# Altium schematic sheet Ethernet_bridge(TOP).SchDoc
size 900 x 699 mm; SheetNumber: 1; SheetTotal: 1; SPICEModelCacheNLVBOJOE: <root> / <DocumentId>NLVBOJOE</DocumentId> / <CacheFrame Number="0"> / <Model Name="5848_744774033_3.3u" Kind="CKT"> / <Text>******* / .subckt 5848_744774033_3.3u 1 2 / Rp 1 2 12000 / Cp 1 2 3.4p / Rs 1 N3 0.042 / L1 N3 2 3.3u / .ends 5848_744774033_3.3u</Text> / </Model> / </CacheFrame> / </root>
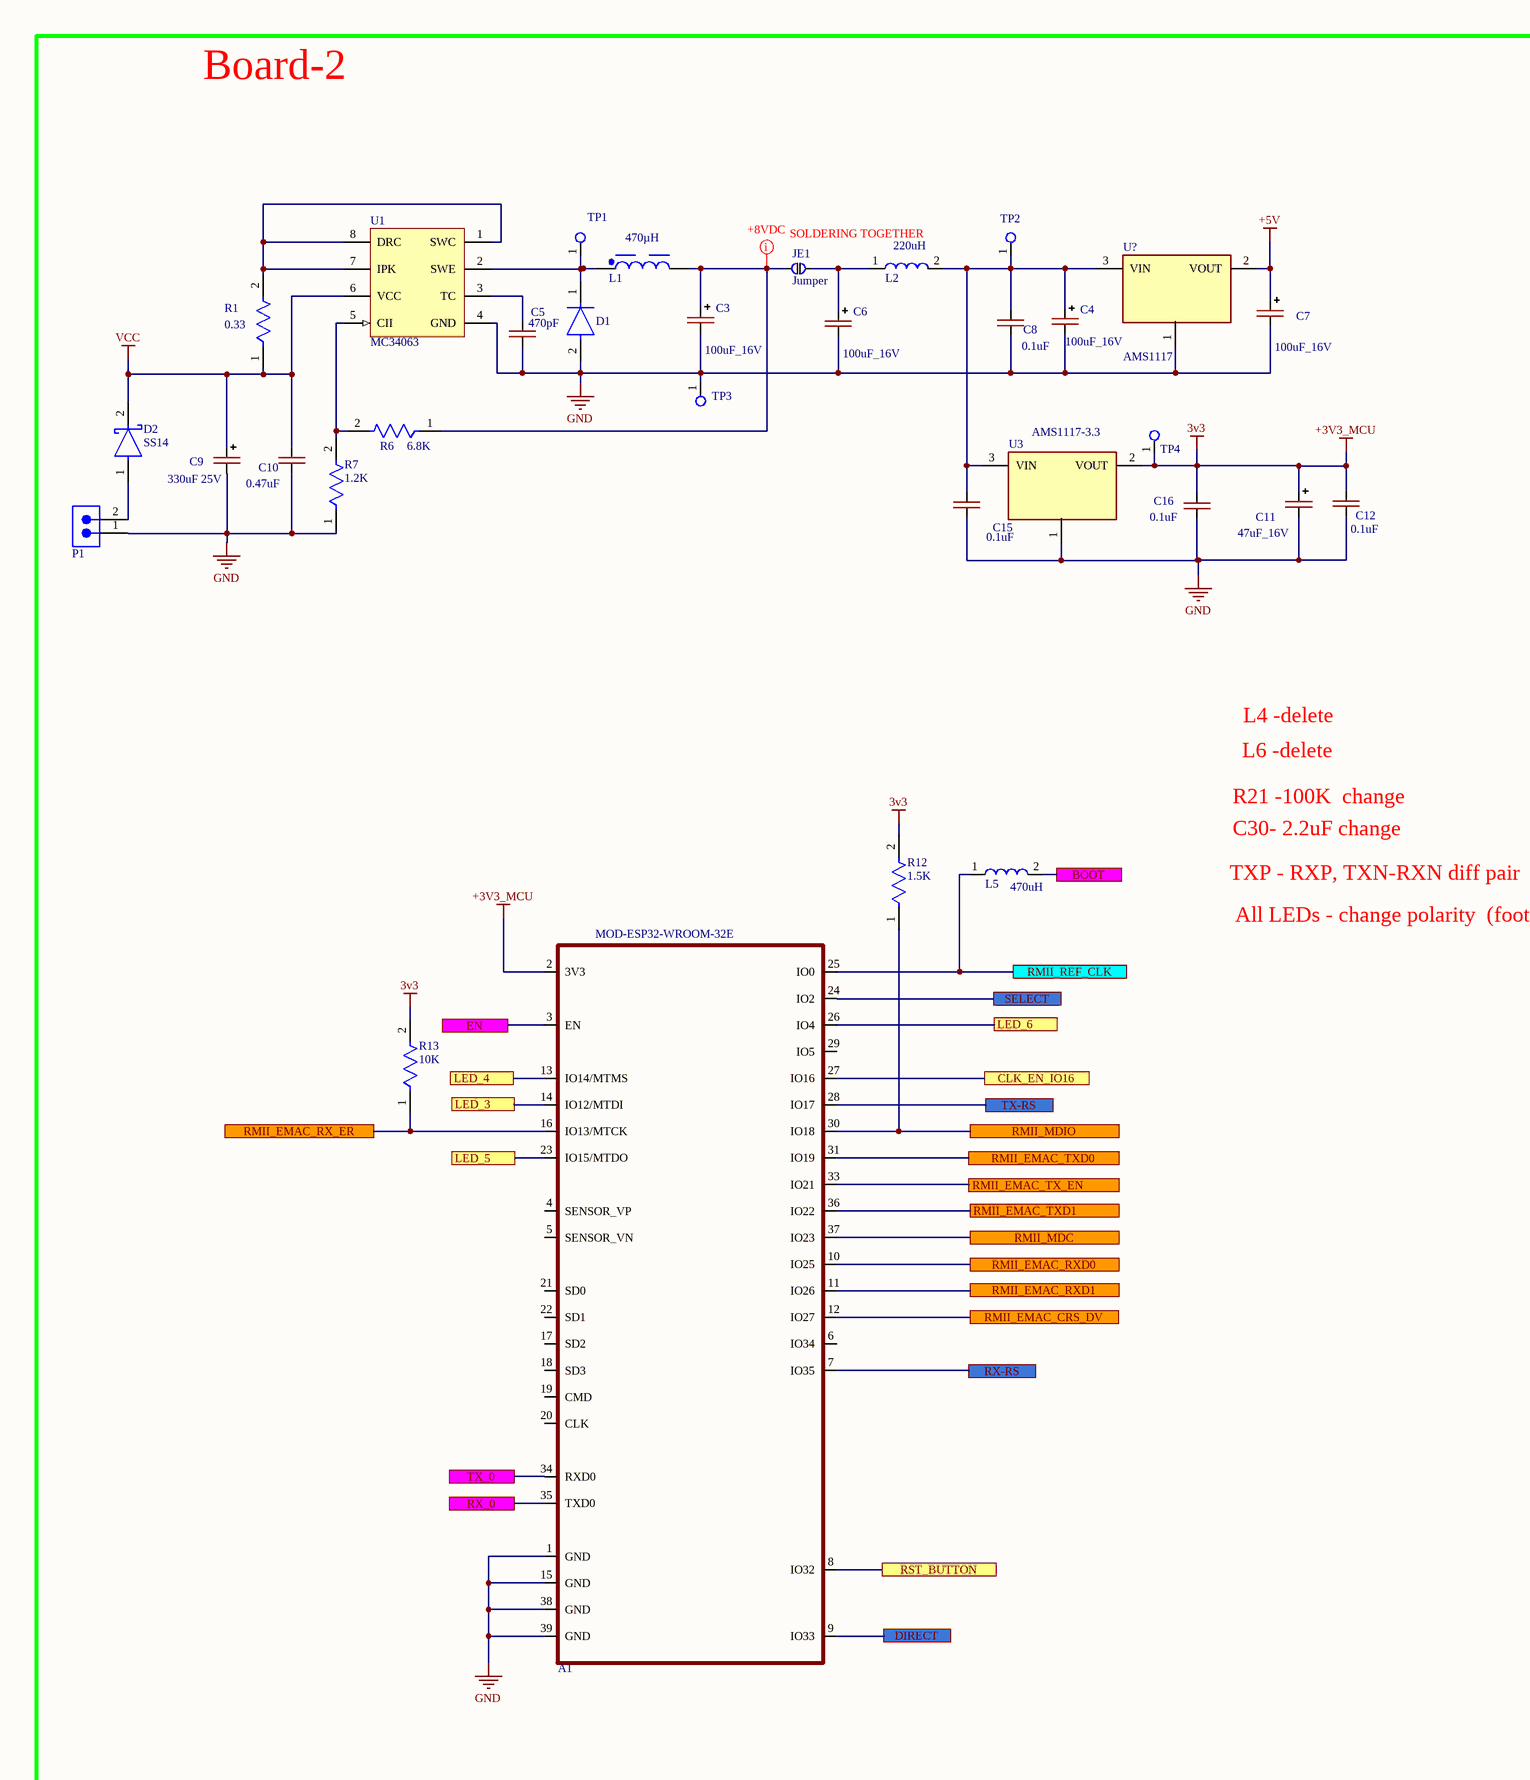
[diagram p0: Ethernet_bridge(TOP).SchDoc, left]
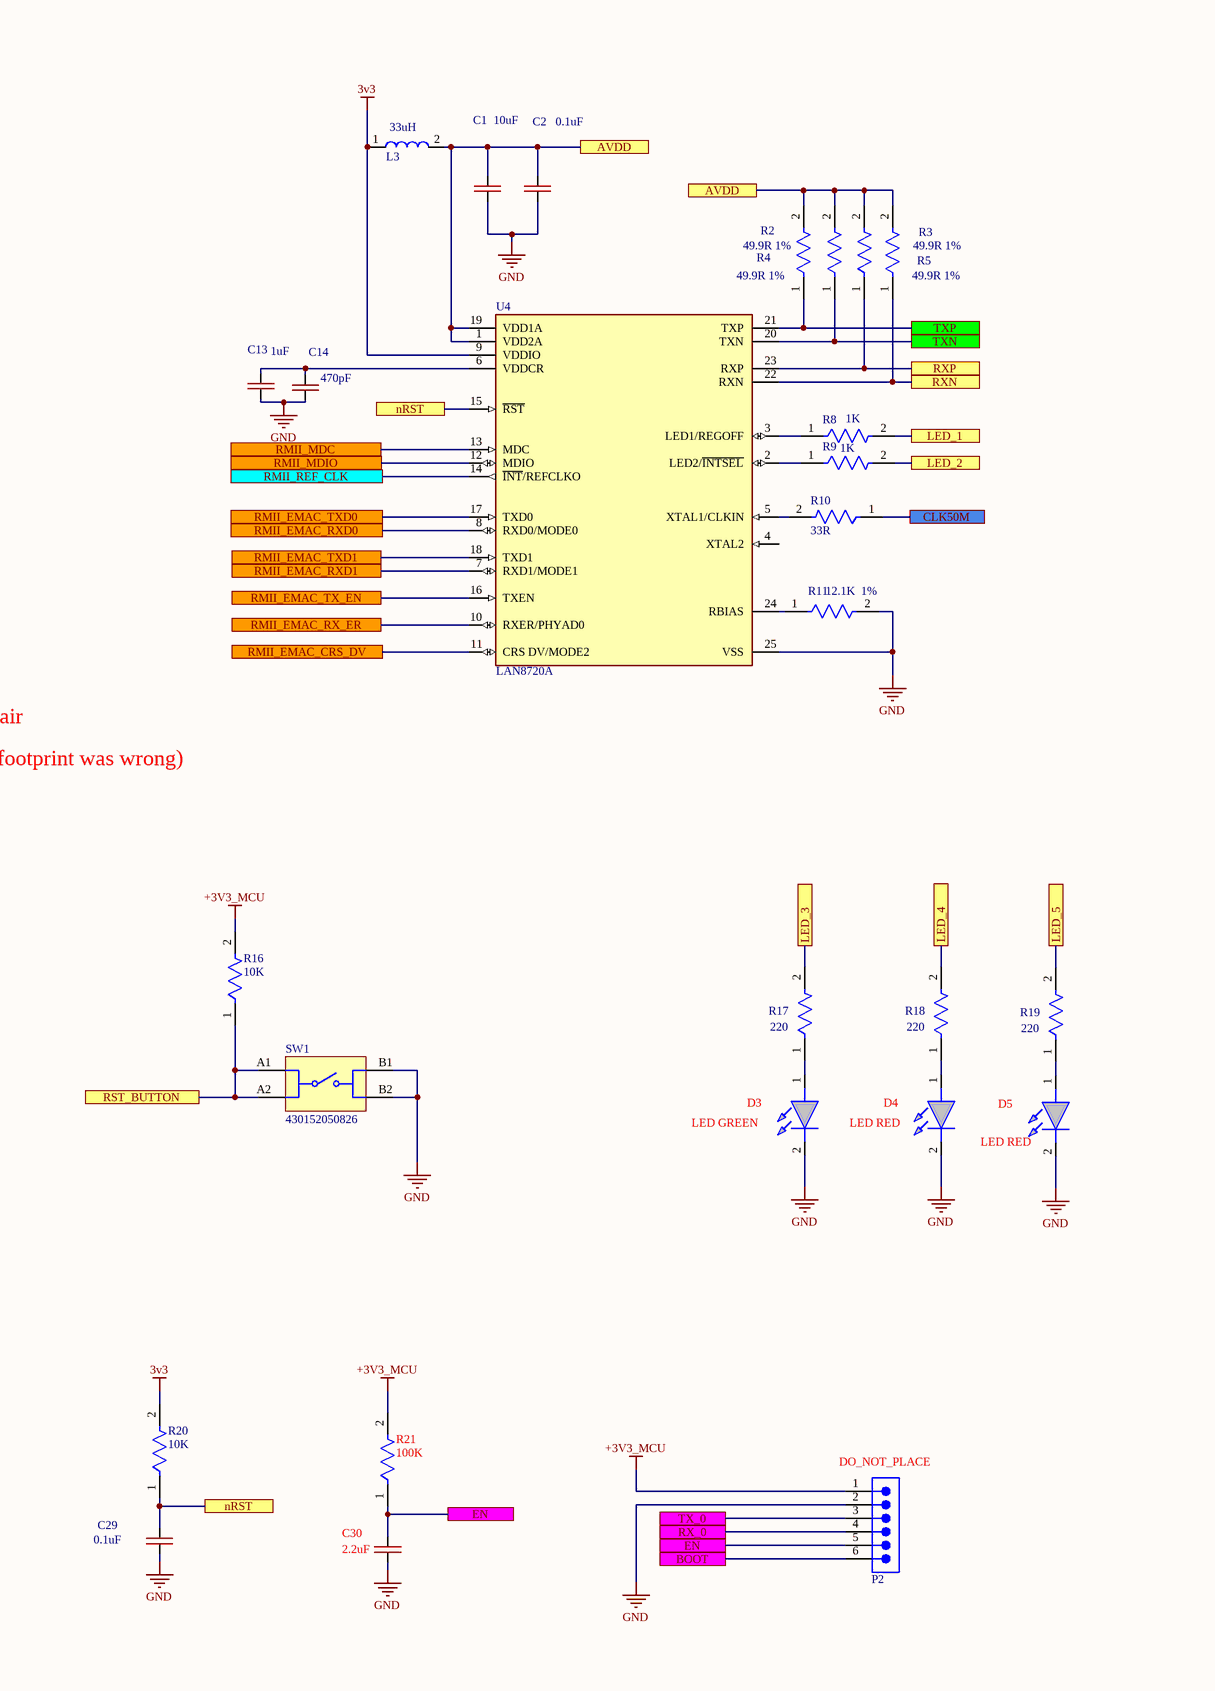
[diagram p1: Ethernet_bridge(TOP).SchDoc, middle]
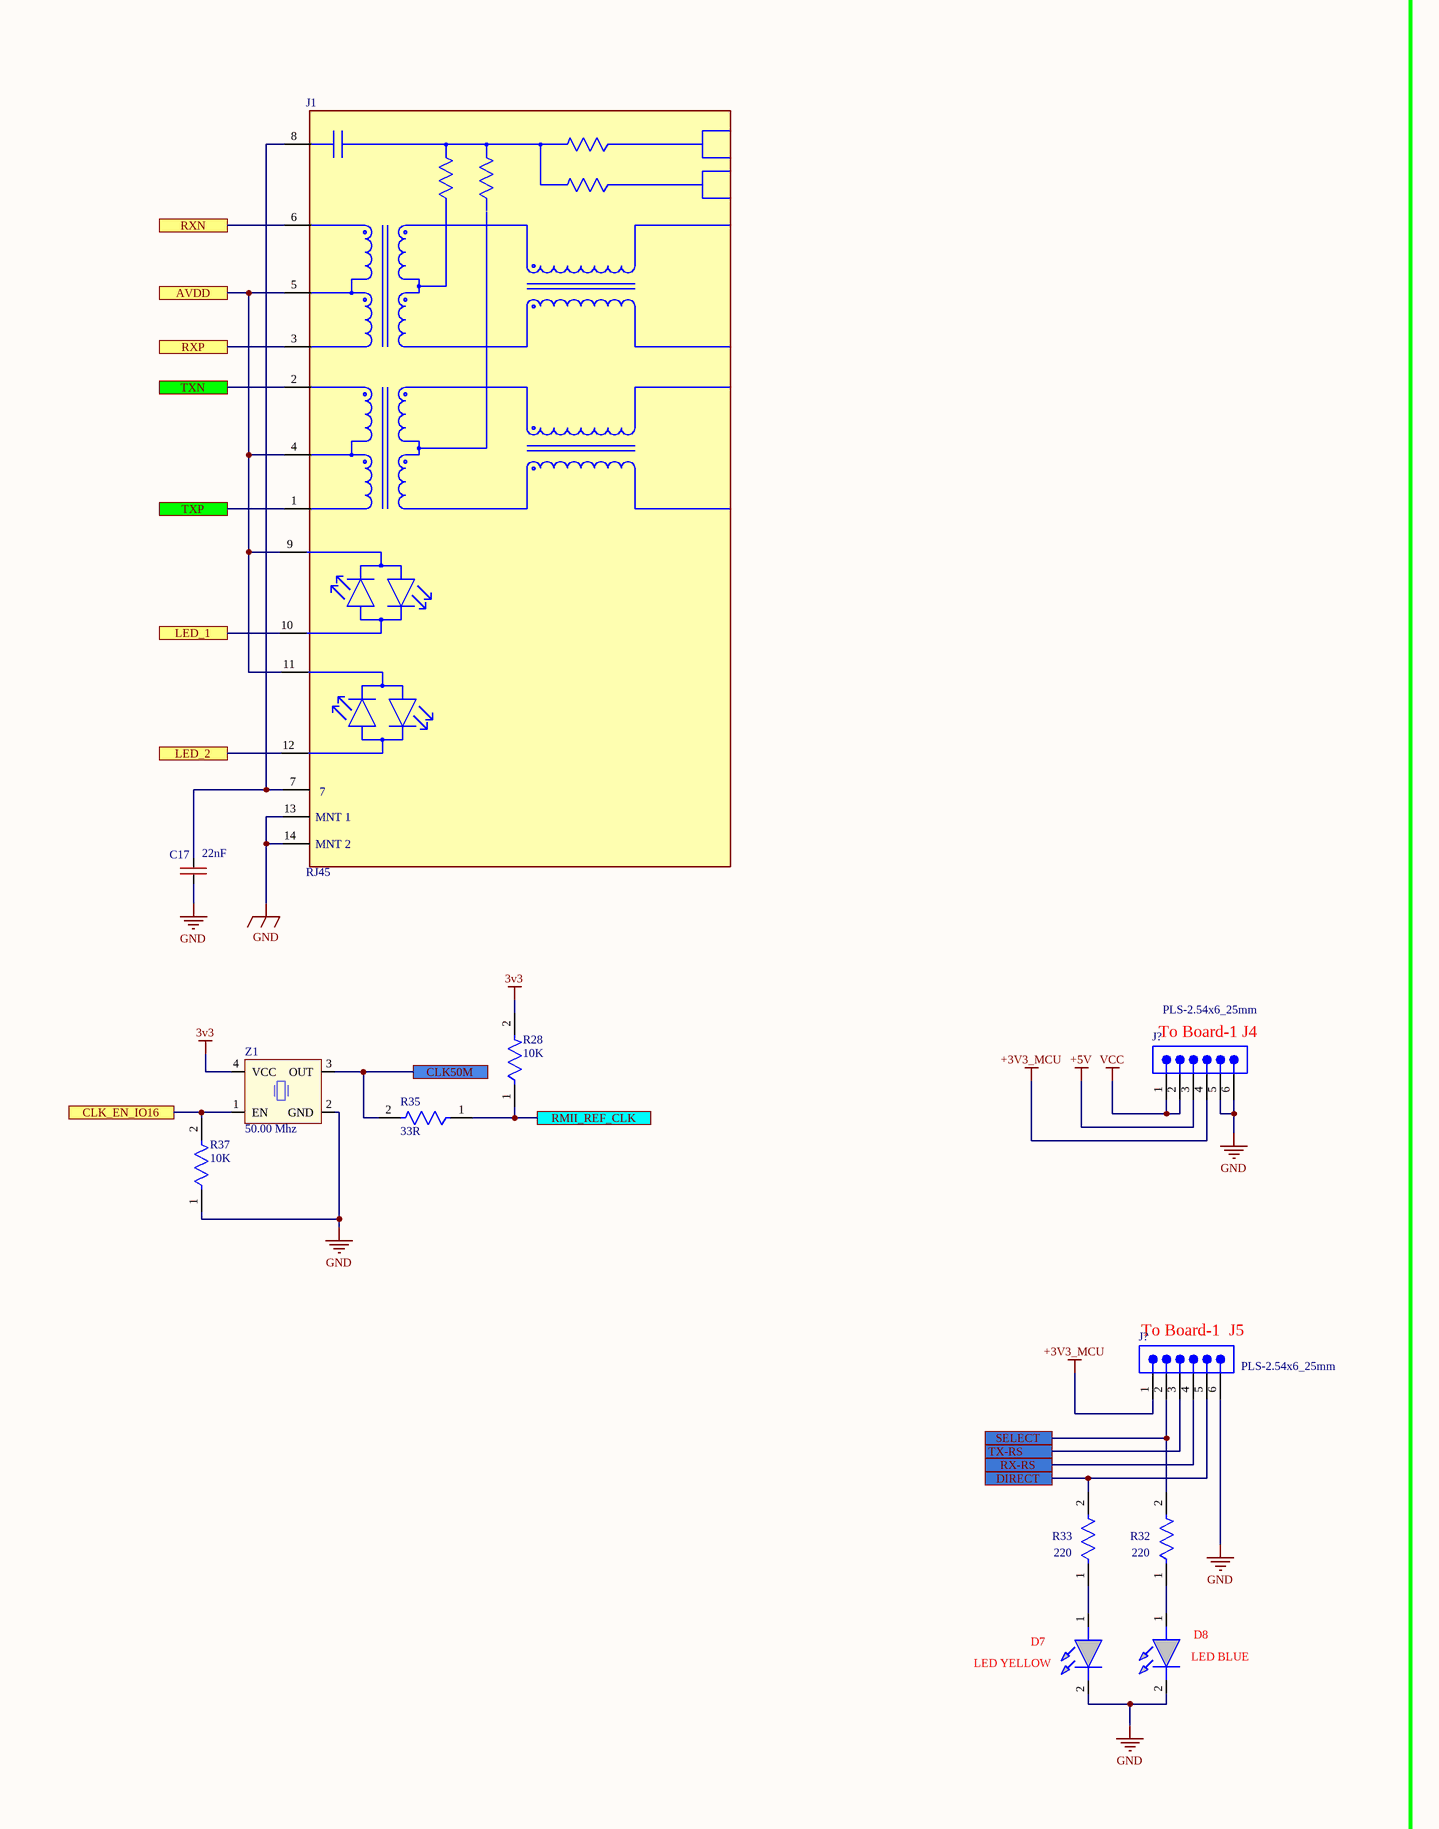
[diagram p2: Ethernet_bridge(TOP).SchDoc, right]

## Parts
(Parts that share a designator on the sheet are numbered #1, #2 ... from top to bottom, then left to right.)
A1  MOD-ESP32-WROOM-32E  [MOD-ESP32-WROOM-32E]
C1  10uF  [CAP-0805]
C2  0.1uF  [CAP-0805]
C3  100uF_16V  [CAP-TAN-D]
C4  100uF_16V  [CAP-TAN-D]
C5  470pF  [CAP-0603]
C6  100uF_16V  [CAP-TAN-D]
C7  100uF_16V  [CAP-TAN-D]
C8  0.1uF  [CAP-0603]
C9  330uF 25V  [CAP_SMD_Size_E]
C10  0.47uF  [CAP-0805]
C11  47uF_16V  [CAP-TAN-D]
C12  0.1uF  [CAP-0603]
C13  1uF  [CAP-0603]
C14  470pF  [CAP-0603]
C15  0.1uF  [CAP-0603]
C16  0.1uF  [CAP-0603]
C17  22nF  [CAP-0603]
C29  0.1uF  [CAP-0603]
C30  2.2uF  [CAP-0603]
D1  ES1G  [FP-403AE-MFG]  (value not drawn)
D2  SS14  [DO-214-AC]
D3  LED GREEN  [LED_GREEN]
D4  LED RED  [LED_RED]
D5  LED RED  [LED_RED]
D7  LED YELLOW  [LED_YELLOW]
D8  LED BLUE  [LED_BLUE]
J1  RJ45  [RJ-45]
J?#1  PLS-2.54x6_25mm  [PLS2.54x25mm]
J?#2  PLS-2.54x6_25mm  [PLS2.54x25mm]
JE1  Jumper  [JE]
L1  470µH  [WE-PD2_5848]
L2  220uH  [Coil_4.5x4.5_mm]
L3  33uH  [Coil_4.5x4.5_mm]
L5  470uH  [Coil_4.5x4.5_mm]
P1  691305540002  [691305540002]  (value not drawn)
P2  61300611121  [61300611121]  (value not drawn)
R1  0.33  [RES-1206]
R2  49.9R 1%  [RES-0603]
R3  49.9R 1%  [RES-0603]
R4  49.9R 1%  [RES-0603]
R5  49.9R 1%  [RES-0603]
R6  6.8K  [RES-0805]
R7  1.2K  [RES-0805]
R8  1K  [RES-0603]
R9  1K  [RES-0603]
R10  33R  [RES-0603]
R11  12.1K  1%  [RES-0603]
R12  1.5K  [RES-0603]
R13  10K  [RES-0603]
R16  10K  [RES-0603]
R17  220  [RES-0603]
R18  220  [RES-0603]
R19  220  [RES-0603]
R20  10K  [RES-0603]
R21  100K  [RES-0603]
R28  10K  [RES-0603]
R32  220  [RES-0603]
R33  220  [RES-0603]
R35  33R  [RES-0603]
R37  10K  [RES-0603]
SW1  430152050826  [430152050826]
TP1  Test_Point_PCB  [Test_Point]  (value not drawn)
TP2  Test_Point_PCB  [Test_Point]  (value not drawn)
TP3  Test_Point_PCB  [Pin_Test_Point(Orange)]  (value not drawn)
TP4  Test_Point_PCB  [Test_Point]  (value not drawn)
U1  MC34063  [SOIC-8_M]
U3  AMS1117-3.3  [SOT-89]
U4  LAN8720A  [24QFN-4x4B-IPC_A]
U?  AMS1117  [SOT-89]
Z1  50.00 Mhz  [50.00Mhz active quartz]

## Ports
AVDD (see Ethernet_bridge(TOP)[3A]), AVDD (see Ethernet_bridge(TOP)[3A], Ethernet_bridge(TOP)[4A]), BOOT (see Ethernet_bridge(TOP)[2B]), BOOT (see Ethernet_bridge(TOP)[3C]), CLK50M (see Ethernet_bridge(TOP)[4B]), CLK50M (see Ethernet_bridge(TOP)[5B]), CLK_EN_IO16 (see Ethernet_bridge(TOP)[2B]), CLK_EN_IO16 (see Ethernet_bridge(TOP)[4B]), DIRECT (see Ethernet_bridge(TOP)[2C]), DIRECT (see Ethernet_bridge(TOP)[5C]), EN (see Ethernet_bridge(TOP)[1B], Ethernet_bridge(TOP)[3C]), EN (see Ethernet_bridge(TOP)[3C]), LED_1 (see Ethernet_bridge(TOP)[4A]), LED_1 (see Ethernet_bridge(TOP)[4B]), LED_2 (see Ethernet_bridge(TOP)[4B]), LED_3 (see Ethernet_bridge(TOP)[1B]), LED_3 (see Ethernet_bridge(TOP)[3B]), LED_4 (see Ethernet_bridge(TOP)[1B]), LED_4 (see Ethernet_bridge(TOP)[4B]), LED_5 (see Ethernet_bridge(TOP)[1B]), LED_5 (see Ethernet_bridge(TOP)[4B]), LED_6, nRST (see Ethernet_bridge(TOP)[3A]), nRST (see Ethernet_bridge(TOP)[3C]), RMII_EMAC_CRS_DV (see Ethernet_bridge(TOP)[2B]), RMII_EMAC_CRS_DV (see Ethernet_bridge(TOP)[3B]), RMII_EMAC_RX_ER (see Ethernet_bridge(TOP)[1B]), RMII_EMAC_RX_ER (see Ethernet_bridge(TOP)[3B]), RMII_EMAC_RXD0 (see Ethernet_bridge(TOP)[2B]), RMII_EMAC_RXD0 (see Ethernet_bridge(TOP)[3B]), RMII_EMAC_RXD1 (see Ethernet_bridge(TOP)[2B]), RMII_EMAC_RXD1 (see Ethernet_bridge(TOP)[3B]), RMII_EMAC_TX_EN (see Ethernet_bridge(TOP)[2B]), RMII_EMAC_TX_EN (see Ethernet_bridge(TOP)[3B]), RMII_EMAC_TXD0 (see Ethernet_bridge(TOP)[2B]), RMII_EMAC_TXD0 (see Ethernet_bridge(TOP)[3B]), RMII_EMAC_TXD1 (see Ethernet_bridge(TOP)[2B]), RMII_EMAC_TXD1 (see Ethernet_bridge(TOP)[3B]), RMII_MDC (see Ethernet_bridge(TOP)[2B]), RMII_MDC (see Ethernet_bridge(TOP)[3A]), RMII_MDIO (see Ethernet_bridge(TOP)[2B]), RMII_MDIO (see Ethernet_bridge(TOP)[3B]), RMII_REF_CLK (see Ethernet_bridge(TOP)[2B], Ethernet_bridge(TOP)[3B]), RMII_REF_CLK (see Ethernet_bridge(TOP)[2B], Ethernet_bridge(TOP)[5B]), RMII_REF_CLK (see Ethernet_bridge(TOP)[3B], Ethernet_bridge(TOP)[5B]), RST_BUTTON (see Ethernet_bridge(TOP)[2C]), RST_BUTTON (see Ethernet_bridge(TOP)[3B]), RX-RS (see Ethernet_bridge(TOP)[2B]), RX-RS (see Ethernet_bridge(TOP)[5C]), RX_0 (see Ethernet_bridge(TOP)[1B]), RX_0 (see Ethernet_bridge(TOP)[3C]), RXN (see Ethernet_bridge(TOP)[4A]), RXP (see Ethernet_bridge(TOP)[4A]), SELECT (see Ethernet_bridge(TOP)[2B]), SELECT (see Ethernet_bridge(TOP)[5C]), TX-RS (see Ethernet_bridge(TOP)[2B]), TX-RS (see Ethernet_bridge(TOP)[5C]), TX_0 (see Ethernet_bridge(TOP)[1B]), TX_0 (see Ethernet_bridge(TOP)[3C]), TXN (see Ethernet_bridge(TOP)[4A]), TXP (see Ethernet_bridge(TOP)[4A]), TXP (see Ethernet_bridge(TOP)[4B])

## Nets
+3V3_MCU: A1.2(3V3) C11.1(+) C12.2 C16.2 J?#1.4 J?#2.1 L3.1 P2.1 R12.2 R13.2 R16.2 R20.2 R21.2 R28.2 TP4.1(G9) U3.2(VOUT) U4.9(VDDIO) Z1.4(VCC)  [also labelled 3v3]
+5V: C7.1(+) J?#1.3 U?.2(VOUT)
GND: A1.1(GND) A1.15(GND) A1.38(GND) A1.39(GND) C1.1 C2.1 C3.2(-) C4.2(-) C5.2 C6.2(-) C7.2(-) C8.1 C9.2(-) C10.2 C11.2(-) C12.1 C13.1 C14.1 C15.1 C16.1 C17.1 C29.1 C30.1 D1.2(A) D3.2(K) D4.2(K) D5.2(K) D7.2(K) D8.2(K) J1.13(MNT_1) J1.14(MNT_2) J?#1.5 J?#1.6 J?#2.6 P1.1 P2.2 R7.1 R11.2 R37.1 SW1.B1 SW1.B2 TP3.1(G9) U1.4(GND) U3.1(Ground) U4.25(VSS) U?.1(Ground) Z1.2(GND)
VCC: C9.1(+) C10.1 D2.2(C) J?#1.1 J?#1.2 R1.1 U1.6(VCC)
AVDD: C1.2 C2.2 J1.4 J1.5 J1.9(2_ANODE_YELLOW/CATHODE_GREEN) J1.11(2_ANODE_YELLOW/CATHODE_GREEN) L3.2 R2.2 R3.2 R4.2 R5.2 U4.1(VDD2A) U4.19(VDD1A) ; port AVDD
BOOT: L5.2 P2.6 ; port BOOT
CLK50M: R10.1 R35.2 Z1.3(OUT) ; port CLK50M
CLK_EN_IO16: A1.27(IO16) R37.2 Z1.1(EN) ; port CLK_EN_IO16
DIRECT: A1.9(IO33) J?#2.5 R33.2 ; port DIRECT
EN: A1.3(EN) C30.2 P2.5 R21.1 ; port EN
LED_1: J1.10(2_CATHODE_YELLOW/ANODE_GREEN) R8.2 ; port LED_1
LED_2: J1.12(2_CATHODE_YELLOW/ANODE_GREEN) R9.2 ; port LED_2
LED_3: A1.14(IO12/MTDI) R17.2 ; port LED_3
LED_4: A1.13(IO14/MTMS) R18.2 ; port LED_4
LED_5: A1.23(IO15/MTDO) R19.2 ; port LED_5
LED_6: A1.26(IO4) ; port LED_6
nRST: C29.2 R20.1 U4.15(~{RST}) ; port nRST
RMII_EMAC_CRS_DV: A1.12(IO27) U4.11(CRS_DV/MODE2) ; port RMII_EMAC_CRS_DV
RMII_EMAC_RX_ER: A1.16(IO13/MTCK) R13.1 U4.10(RXER/PHYAD0) ; port RMII_EMAC_RX_ER
RMII_EMAC_RXD0: A1.10(IO25) U4.8(RXD0/MODE0) ; port RMII_EMAC_RXD0
RMII_EMAC_RXD1: A1.11(IO26) U4.7(RXD1/MODE1) ; port RMII_EMAC_RXD1
RMII_EMAC_TX_EN: A1.33(IO21) U4.16(TXEN) ; port RMII_EMAC_TX_EN
RMII_EMAC_TXD0: A1.31(IO19) U4.17(TXD0) ; port RMII_EMAC_TXD0
RMII_EMAC_TXD1: A1.36(IO22) U4.18(TXD1) ; port RMII_EMAC_TXD1
RMII_MDC: A1.37(IO23) U4.13(MDC) ; port RMII_MDC
RMII_MDIO: A1.30(IO18) R12.1 U4.12(MDIO) ; port RMII_MDIO
RMII_REF_CLK: A1.25(IO0) L5.1 R28.1 R35.1 U4.14(~{INT}/REFCLKO) ; port RMII_REF_CLK
RST_BUTTON: A1.8(IO32) R16.1 SW1.A1 SW1.A2 ; port RST_BUTTON
RX-RS: A1.7(IO35) J?#2.4 ; port RX-RS
RX_0: A1.35(TXD0) P2.4 ; port RX_0
RXN: J1.6 R5.1 U4.22(RXN) ; port RXN
RXP: J1.3 R3.1 U4.23(RXP) ; port RXP
SELECT: A1.24(IO2) J?#2.2 R32.2 ; port SELECT
TX-RS: A1.28(IO17) J?#2.3 ; port TX-RS
TX_0: A1.34(RXD0) P2.3 ; port TX_0
TXN: J1.2 R4.1 U4.20(TXN) ; port TXN
TXP: J1.1 R2.1 U4.21(TXP) ; port TXP
NetC3_1: C3.1(+) JE1.2 L1.2 R6.1
NetC4_1: C4.1(+) C8.2 C15.2 L2.2 TP2.1(G9) U3.3(VIN) U?.3(VIN)
NetC5_1: C5.1 U1.3(TC)
NetC6_1: C6.1(+) JE1.1 L2.1
NetC13_2: C13.2 C14.2 U4.6(VDDCR)
NetC17_2: C17.2 J1.7 J1.8
NetD1_1: D1.1(C) L1.1 TP1.1(G9) U1.2(SWE)
NetD2_1: D2.1(A) P1.2
NetD3_1: D3.1(A) R17.1
NetD4_1: D4.1(A) R18.1
NetD5_1: D5.1(A) R19.1
NetD7_1: D7.1(A) R33.1
NetD8_1: D8.1(A) R32.1
NetR1_2: R1.2 U1.1(SWC) U1.7(IPK) U1.8(DRC)
NetR6_2: R6.2 R7.2 U1.5(CII)
NetR8_1: R8.1 U4.3(LED1/REGOFF)
NetR9_1: R9.1 U4.2(LED2/~{INTSEL})
NetR10_2: R10.2 U4.5(XTAL1/CLKIN)
NetR11_1: R11.1 U4.24(RBIAS)

Not connected (* = marked no-connect by the designer): A1 4(SENSOR_VP) 5(SENSOR_VN) 6(IO34) 17(SD2) 18(SD3) 19(CMD) 20(CLK) 21(SD0) 22(SD1) 29(IO5); U4 4(XTAL2)

## Layout directives
mark named +8VDC: (no net found under the mark)

## Notes on the sheet
- Board-2
- SOLDERING TOGETHER
- L4 -delete
- L6 -delete
- R21 -100K  change
- C30- 2.2uF change
- TXP - RXP, TXN-RXN diff pair
- All LEDs - change polarity  (footprint was wrong)
- (near J?#1) To Board-1 J4
- (near J?#2) To Board-1  J5
- (near P2) DO_NOT_PLACE

## Library data of the parts
C1 C2 C5 C8 C10 C12-C17 C29 C30 = CAP-NON-POLAR
C3 C4 C6 C7 C9 = CAP_POL_SMD
C11 = CAP-POLAR
D1 = ES1G: Ultrafast
D3-D5 D7 D8 = LED: WURTH ELEKTRONIK - 151031YS06000 - LED, Yellow, Through Hole, T-1 (3mm), 30 mA, 2 V, 590 nm; Geometry.Height: 5.5mm; Manufacturer_Name: Wurth Elektronik; Manufacturer_Part_Number: 151031YS06000; Mouser Part Number: 710-151031YS06000; Mouser Price/Stock: https://www.mouser.co.uk/ProductDetail/Wurth-Elektronik/151031YS06000?qs=LlUlMxKIyB3xSYYW%252BcuBiQ%3D%3D; Arrow Part Number: *; Arrow Price/Stock: *; Mouser Testing Part Number: *; Mouser Testing Price/Stock: *; Datasheet Link: https://katalog.we-online.de/led/datasheet/151031YS06000.pdf
J1 = HRK1-1B72F09
JE1 = JE
L1 = 744774033: WE-PD2 SMT Power Inductor, size 5848, 3.3µH, 4A, 0.06Ω; Manufacturer: Wurth Elektronik; Case/Size Code: 5848; DC Resistance: 0.042Ω; Saturation Current: 7.5A; Self Resonant Frequency: 43MHz; Manufacturer Part Number: 744774033; Category: Unshielded Power Inductors; Match Code: WE-PD2; ComponentLink1Description: Website Link; ComponentLink1URL: https://www.we-online.com/redexpert/article/744774033?ad; ComponentLink2Description: Datasheet Link; ComponentLink2URL: https://www.we-online.com/redexpert/spec/744774033?ad; Mount: Surface Mount; Operating Temperature Max: 125°C; Operating Temperature Min: -40°C; Packaging: Tape and Reel; Length: 5.8mm; Width: 5.2mm; Height: 4.5mm; DC Resistance Max: 0.06Ω; Inductance: 3.3µH; Rated Current: 4A
L2 L3 L5 = Coil
P1 = 691305540002: WR-TBL Series 3055 PCB Header Horizontal Entry with Plastic Latches, THT, pitch 5.08mm, 2p; Manufacturer: Wurth Elektronik; Modularity: No; Rated Current: 16A; Working Voltage: 300V; ComponentLink1Description: Website Link; ComponentLink1URL: https://www.we-online.com/redexpert/article/691305540002?ad; ComponentLink2Description: Datasheet Link; ComponentLink2URL: https://www.we-online.com/redexpert/spec/691305540002?ad; Manufacturer Part Number: 691305540002; Category: Terminal Blocks; Match Code: WR-TBL; Mount: Through Hole; Operating Temperature Max: 105°C; Operating Temperature Min: -40°C; Packaging: Box; Application: Pluggable; Number of Pins: 2; Number of Rows: 1; Orientation: Horizontal; Pitch: 5.08mm
P2 = 61300611121: WR-PHD Pin Header, THT, Vertical, pitch 2.54mm, 1 Row, 6P; Manufacturer: Wurth Elektronik; Contact Resistance: 20mΩ; Rated Current: 3A; Working Voltage: 250V; Withstanding Voltage: 500V; ComponentLink1Description: Website Link; ComponentLink1URL: https://www.we-online.com/redexpert/article/61300611121?ad; ComponentLink2Description: Datasheet Link; ComponentLink2URL: https://www.we-online.com/redexpert/spec/61300611121?ad; Manufacturer Part Number: 61300611121; Category: Board-to-Board Connectors; Match Code: WR-PHD; Mount: Through Hole; Operating Temperature Max: 105°C; Operating Temperature Min: -40°C; Packaging: Bag; Gender: Pin Header; Number of Pins: 6; Number of Rows: 1; Orientation: Vertical; Pitch: 2.54mm
R1-R10 R12 R13 R16-R20 R28 R32 R33 R35 R37 = RES-CONST
R11 = RES-CONST: 12.1K
R21 = RES-CONST: 10K
SW1 = 430152050826: WS-TASV SMT Tact Switch, 6mm x 6mm, 260gf, SPST-NO, 12V, 50mA; Manufacturer: Wurth Elektronik; Washable: No; Manufacturer Part Number: 430152050826; Category: Tact Switch; Match Code: WS-TASV; ComponentLink1Description: Website Link; ComponentLink1URL: https://www.we-online.com/redexpert/article/430152050826?ad; ComponentLink2Description: Datasheet Link; ComponentLink2URL: https://www.we-online.com/redexpert/spec/430152050826?ad; Mount: Surface Mount; Min Operating Temperature: -40°C; Max Operating Temperature: 85°C; Packaging: Tape and Reel; Length: 6mm; Width: 6mm; Height: 5mm; Circuit: SPST-NO; Contact Material: Stainless Steel; Contact Plating: Silver; Operation Force: 260gf; Rated Current: 50mA; Rated Voltage (DC): 12V; Terminal Material: Copper Alloy; Terminal Plating: Silver
TP1-TP4 = TP_PCB?: Test_Point
U3 = AMS1117
U4 = LAN7820A
Z1 = Crystal_50Mhz_active